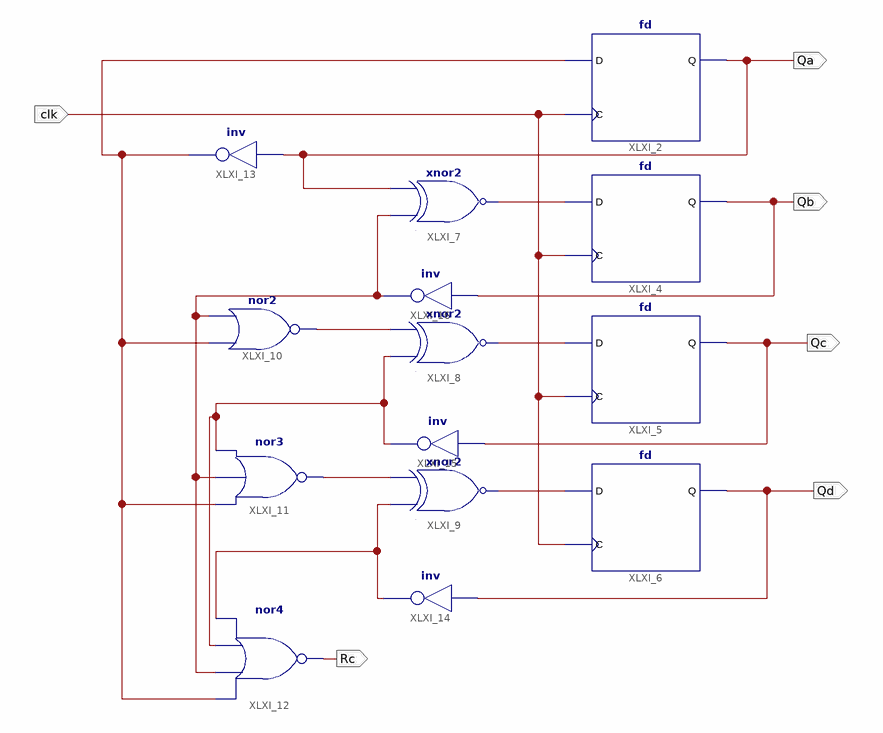
[diagram p0: schematic sheet 1]
// Xilinx ISE schematic Counter_4bit.sch (kintex7) as structural Verilog: 14 symbols, 6 ports
module Counter_4bit (
  input  clk,
  output Qa,
  output Qb,
  output Qc,
  output Qd,
  output Rc
);

  wire XLXN_11, XLXN_13, XLXN_14, XLXN_16, XLXN_17, XLXN_18, XLXN_19, XLXN_20, XLXN_21;

  fd XLXI_2 (.C(clk), .D(XLXN_14), .Q(Qa));
  fd XLXI_4 (.C(clk), .D(XLXN_11), .Q(Qb));
  fd XLXI_5 (.C(clk), .D(XLXN_20), .Q(Qc));
  fd XLXI_6 (.C(clk), .D(XLXN_21), .Q(Qd));
  xnor XLXI_7 (XLXN_11, XLXN_13, Qa);
  xnor XLXI_8 (XLXN_20, XLXN_16, XLXN_18);
  xnor XLXI_9 (XLXN_21, XLXN_17, XLXN_19);
  nor XLXI_10 (XLXN_18, XLXN_14, XLXN_13);
  nor XLXI_11 (XLXN_19, XLXN_14, XLXN_13, XLXN_16);
  nor XLXI_12 (Rc, XLXN_14, XLXN_13, XLXN_16, XLXN_17);
  not XLXI_13 (XLXN_14, Qa);
  not XLXI_14 (XLXN_17, Qd);
  not XLXI_15 (XLXN_16, Qc);
  not XLXI_16 (XLXN_13, Qb);
endmodule
